# Altium schematic sheet 11. LCD.SchDoc
size A4; CheckedBy: 黄钦宁; Author: 陈坤; DocumentNumber: 11; SheetNumber: 11; SheetTotal: 13; PageSetup: Record=PageOptions|CenterHorizontal=True|CenterVertical=True|PrintScale=1.00|XCorrection=1.00|YCorrection=1.00|PrintKind=0|BorderSize=5000000|LeftOffset=0|BottomOffset=0|Orientation=2|PaperLength=1000|PaperWidth=1000|Scale=100|PaperSource=7|PrintQuality=600|MediaType=1|DitherType=10|PaperKind=A4|PrintScaleMode=1; DesignDate: 2013-08-16; CheckDate: 2013-12-28; SheetName: LCD; SheetVersion: V1.00; SheetDescription: 液晶屏接口; ProductName: EasyARM-iMX28学习套件; ProductModel: EasyARM-iMX283
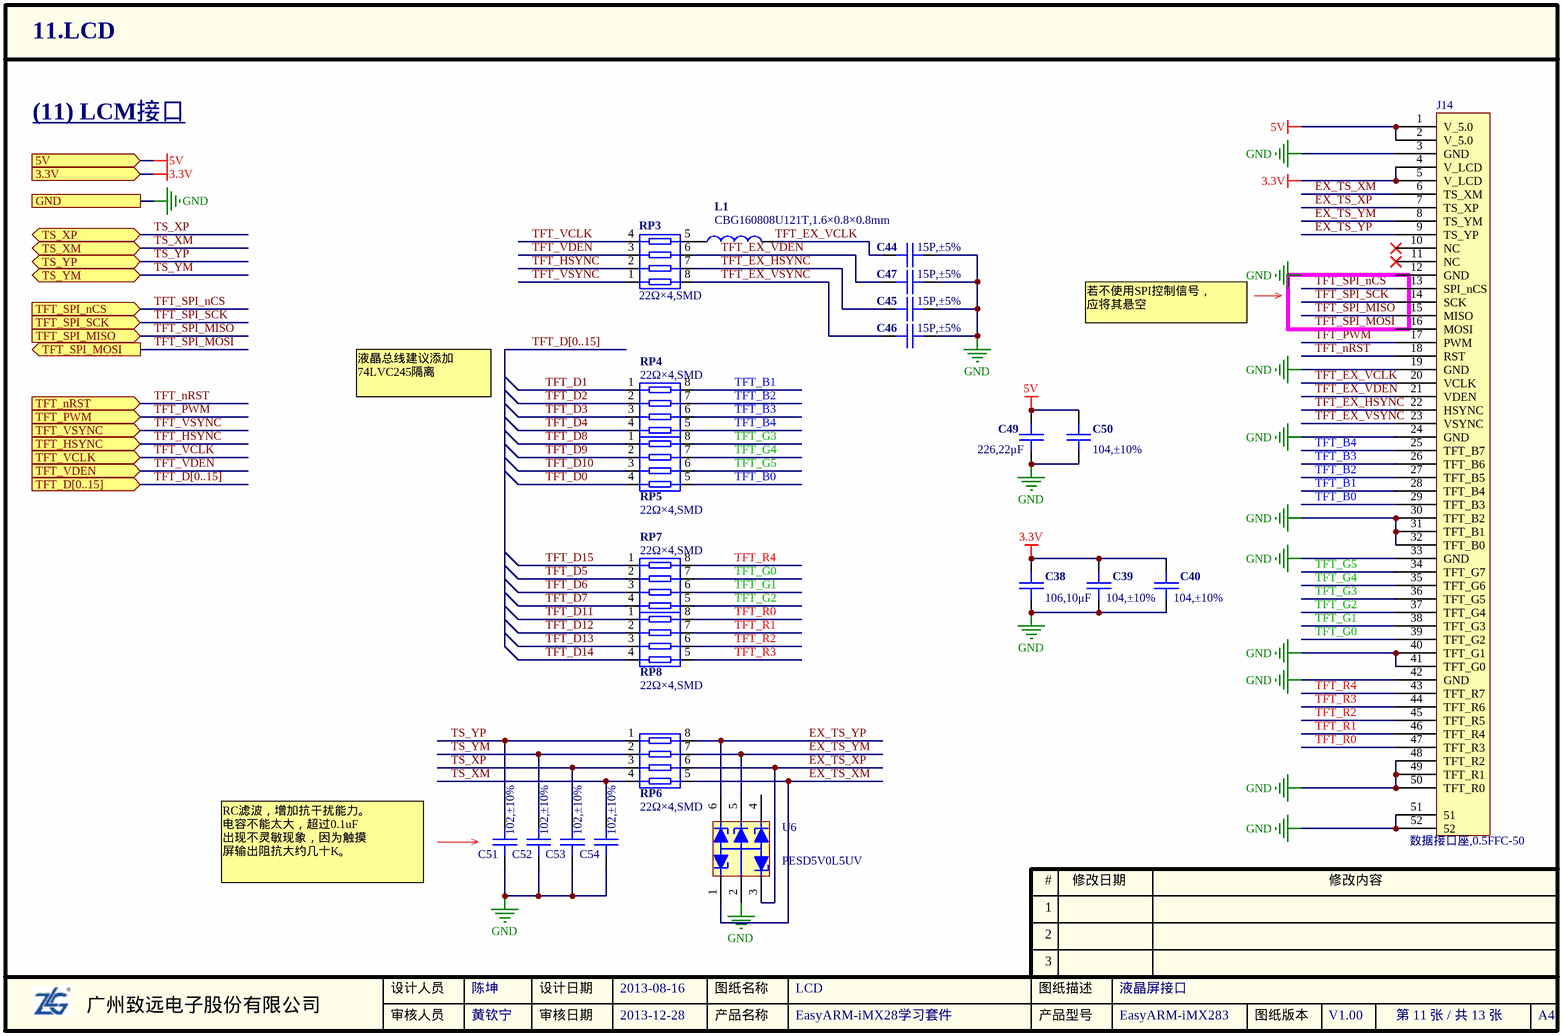
[diagram p0: 11. LCD.SchDoc]

## Parts
C38  106,10μF  [0805C]
C39  104,±10%  [0603C]
C40  104,±10%  [0603C]
C44  15P,±5%  [0603C]
C45  15P,±5%  [0603C]
C46  15P,±5%  [0603C]
C47  15P,±5%  [0603C]
C49  226,22μF  [0805C]
C50  104,±10%  [0603C]
C51  102,±10%  [0603C]
C52  102,±10%  [0603C]
C53  102,±10%  [0603C]
C54  102,±10%  [0603C]
J14  value 数据接口座,0.5FFC-50  [FFC0.5-50P-A]  (hidden comment: FPC-50)
L1  value CBG160808U121T,1.6×0.8×0.8mm  [0603R]  (hidden comment: INDUCTOR1)
RP3  22Ω×4,SMD  [0603RA]
RP4  22Ω×4,SMD  [0603RA]
RP5  22Ω×4,SMD  [0603RA]
RP6  22Ω×4,SMD  [0603RA]
RP7  22Ω×4,SMD  [0603RA]
RP8  22Ω×4,SMD  [0603RA]
U6  PESD5V0L5UV  [SOT-666]

## Ports
3.3V, 5V, GND, TFT_D[0..15] (in), TFT_HSYNC (in), TFT_nRST (in), TFT_PWM (in), TFT_SPI_MISO (in), TFT_SPI_MOSI (out), TFT_SPI_nCS (in), TFT_SPI_SCK (in), TFT_VCLK (in), TFT_VDEN (in), TFT_VSYNC (in), TS_XM (bidir), TS_XP (bidir), TS_YM (bidir), TS_YP (bidir)

## Nets
3.3V: C38.1 C39.1 C40.1 J14.4(V_LCD) J14.5(V_LCD) ; port 3.3V
5V: C49.1 C50.1 J14.1(V_5.0) J14.2(V_5.0) ; port 5V
GND: C38.2 C39.2 C40.2 C44.2 C45.2 C46.2 C47.2 C49.2 C50.2 C51.2 C52.2 C53.2 C54.2 J14.3(GND) J14.12(GND) J14.19(GND) J14.24(GND) J14.30(TFT_B2) J14.31(TFT_B1) J14.32(TFT_B0) J14.33(GND) J14.40(TFT_G1) J14.41(TFT_G0) J14.42(GND) J14.48(TFT_R2) J14.49(TFT_R1) J14.50(TFT_R0) J14.51 J14.52 U6.2 ; port GND
EX_TS_XM: J14.6(TS_XM) RP6.5 U6.1
EX_TS_XP: J14.7(TS_XP) RP6.6 U6.3
EX_TS_YM: J14.8(TS_YM) RP6.7 U6.5
EX_TS_YP: J14.9(TS_YP) RP6.8 U6.6
TFT_B0: J14.29(TFT_B3) RP5.5
TFT_B1: J14.28(TFT_B4) RP4.8
TFT_B2: J14.27(TFT_B5) RP4.7
TFT_B3: J14.26(TFT_B6) RP4.6
TFT_B4: J14.25(TFT_B7) RP4.5
TFT_D0: RP5.4
TFT_D1: RP4.1
TFT_D2: RP4.2
TFT_D3: RP4.3
TFT_D4: RP4.4
TFT_D5: RP7.2
TFT_D6: RP7.3
TFT_D7: RP7.4
TFT_D8: RP5.1
TFT_D9: RP5.2
TFT_D10: RP5.3
TFT_D11: RP8.1
TFT_D12: RP8.2
TFT_D13: RP8.3
TFT_D14: RP8.4
TFT_D15: RP7.1
TFT_EX_HSYNC: C45.1 J14.22(HSYNC) RP3.7
TFT_EX_VCLK: C44.1 J14.20(VCLK) L1.2
TFT_EX_VDEN: C47.1 J14.21(VDEN) RP3.6
TFT_EX_VSYNC: C46.1 J14.23(VSYNC) RP3.8
TFT_G0: J14.39(TFT_G2) RP7.7
TFT_G1: J14.38(TFT_G3) RP7.6
TFT_G2: J14.37(TFT_G4) RP7.5
TFT_G3: J14.36(TFT_G5) RP5.8
TFT_G4: J14.35(TFT_G6) RP5.7
TFT_G5: J14.34(TFT_G7) RP5.6
TFT_HSYNC: RP3.2 ; port TFT_HSYNC
TFT_nRST: J14.18(RST) ; port TFT_nRST
TFT_PWM: J14.17(PWM) ; port TFT_PWM
TFT_R0: J14.47(TFT_R3) RP8.8
TFT_R1: J14.46(TFT_R4) RP8.7
TFT_R2: J14.45(TFT_R5) RP8.6
TFT_R3: J14.44(TFT_R6) RP8.5
TFT_R4: J14.43(TFT_R7) RP7.8
TFT_SPI_MISO: J14.15(MISO) ; port TFT_SPI_MISO
TFT_SPI_MOSI: J14.16(MOSI) ; port TFT_SPI_MOSI
TFT_SPI_nCS: J14.13(SPI_nCS) ; port TFT_SPI_nCS
TFT_SPI_SCK: J14.14(SCK) ; port TFT_SPI_SCK
TFT_VCLK: RP3.4 ; port TFT_VCLK
TFT_VDEN: RP3.3 ; port TFT_VDEN
TFT_VSYNC: RP3.1 ; port TFT_VSYNC
TS_XM: C54.1 RP6.4 ; port TS_XM
TS_XP: C53.1 RP6.3 ; port TS_XP
TS_YM: C52.1 RP6.2 ; port TS_YM
TS_YP: C51.1 RP6.1 ; port TS_YP
NetL1_1: L1.1 RP3.5

Not connected (* = marked no-connect by the designer): J14 10(NC)* 11(NC)*; U6 4

## Buses and harness runs
bus TFT_D[0..15]
bus TFT_D[0..15] = port TFT_D[0..15]

## Notes on the sheet
- (11) LCM接口
- 若不使用SPI控制信号，
  应将其悬空
- 液晶总线建议添加
  74LVC245隔离
- RC滤波，增加抗干扰能力。
  电容不能太大，超过0.1uF
  出现不灵敏现象，因为触摸
  屏输出阻抗大约几十K。
- 1
- #
- 修改日期
- 修改内容
- 2
- 3
- 广州致远电子股份有限公司
- 设计人员
- 审核人员
- 设计日期
- 审核日期
- 产品名称
- 图纸名称
- 产品型号
- 图纸描述
- 图纸版本
- A4

## Library data of the parts
C38 = 1.02.02.0055: 106,10μF,±10%,10V,X5R,0805,RoHS; 名称: 电容; 封装: 0805; 设备封装名称: C0805_106_X5R_10V_10%; 贴片和直插: SMT; 物料代码: 1.02.02.0055; Value: 106,10μF; RoHS: RoHS; 型号: 106,10μF,±10%,10V,X5R; ComponentLink1Description: ErpDataInfo; ComponentLink1URL: http://erp.zlgmcu.com/ErpExt/ErpData/ListMateriel.aspx?pkey=1.02.02.0055
C39 C40 C50 = 1.02.01.0032: 104,±10%,50V,X7R,0603,*,RoHS; 名称: 电容; 封装: 0603; 设备封装名称: C0603_104_X7R_50V_10%; 贴片和直插: SMT; 物料代码: 1.02.01.0032; Value: 104,±10%; RoHS: RoHS; 型号: 104,±10%,50V,X7R; ComponentLink1Description: ErpDataInfo; ComponentLink1URL: http://erp.zlgmcu.com/ErpExt/ErpData/ListMateriel.aspx?pkey=1.02.01.0032
C44-C47 = 1.02.01.0002: 15P,±5%,50V,COG,0603,*,RoHS; 名称: 电容; 封装: 0603; 设备封装名称: C0603_15P_COG_50V_5%; 贴片和直插: SMT; 物料代码: 1.02.01.0002; Value: 15P,±5%; RoHS: RoHS; 型号: 15P,±5%,50V,COG; ComponentLink1Description: ErpDataInfo; ComponentLink1URL: http://erp.zlgmcu.com/ErpExt/ErpData/ListMateriel.aspx?pkey=1.02.01.0002
C49 = 1.02.02.0059: 226,22μF,±20%,6.3V,X5R,0805,RoHS; 名称: 电容; 封装: 0805; 设备封装名称: C0805_226_X5R_6.3V_20%; 贴片和直插: SMT; 物料代码: 1.02.02.0059; Value: 226,22μF; RoHS: RoHS; 型号: 226,22μF,±20%,6.3V,X5R; ComponentLink1Description: ErpDataInfo; ComponentLink1URL: http://erp.zlgmcu.com/ErpExt/ErpData/ListMateriel.aspx?pkey=1.02.02.0059
C51-C54 = 1.02.01.0020: 102,±10%,50V,X7R,0603,*,RoHS; 名称: 电容; 封装: 0603; 设备封装名称: C0603_102_X7R_50V_10%; 贴片和直插: SMT; 物料代码: 1.02.01.0020; Value: 102,±10%; RoHS: RoHS; 型号: 102,±10%,50V,X7R; ComponentLink1Description: ErpDataInfo; ComponentLink1URL: http://erp.zlgmcu.com/ErpExt/ErpData/ListMateriel.aspx?pkey=1.02.01.0020
J14 = 1.10.01.0028: 数据接口座,0.5FFC-50,SMD,下接,RoHS; 名称: 连接器-SMD; 贴片和直插: SMT; 物料代码: 1.10.01.0028; RoHS: RoHS; 型号: 数据接口座,0.5FFC-50,SMD,下接; ComponentLink1Description: ErpDataInfo; ComponentLink1URL: http://erp.zlgmcu.com/ErpExt/ErpData/ListMateriel.aspx?pkey=1.10.01.0028
L1 = 1.03.03.0007: CBG160808U121T,1.6×0.8×0.8mm,0603,RoHS; 名称: 磁珠; 封装: 0603; 设备封装名称: FB0603_121T; 贴片和直插: SMT; 物料代码: 1.03.03.0007; RoHS: RoHS; 型号: CBG160808U121T,1.6×0.8×0.8mm; ComponentLink1Description: ErpDataInfo; ComponentLink1URL: http://erp.zlgmcu.com/ErpExt/ErpData/ListMateriel.aspx?pkey=1.03.03.0007
RP3-RP8 = 1.01.04.0001: 名称: 网络电阻; 规格型号: 22Ω×4,SMD,PZ-4-0.8,RoHS; 现有库存: 85384; 封装: PZ-4-0.8; 设备封装名称: 22R_4_0603; 贴片和直插: SMT; 物料代码: 1.01.04.0001; Value: 22Ω×4,SMD; ComponentLink1Description: ErpDataInfo; ComponentLink1URL: http://erp.zlgmcu.com/ErpExt/ErpData/ListMateriel.aspx?pkey=1.01.04.0001; RoHS: RoHS
U6 = 1.05.10.0189: PESD5V0L5UV,SOT-666,NXP,RoHS; 名称: IC; 设备封装名称: SOT-666_PESD5V0L5UV; 贴片和直插: SMT; 物料代码: 1.05.10.0189; Value: PESD5V0L5UV; 封装: SOT-666; 厂商: NXP; RoHS: RoHS; 型号: PESD5V0L5UV; ComponentLink1Description: ErpDataInfo; ComponentLink1URL: http://erp.zlgmcu.com/ErpExt/ErpData/ListMateriel.aspx?pkey=1.05.10.0189